# Altium schematic sheet PressSensor1.SchDoc
size A4; SheetNumber: 7; SheetTotal: 10
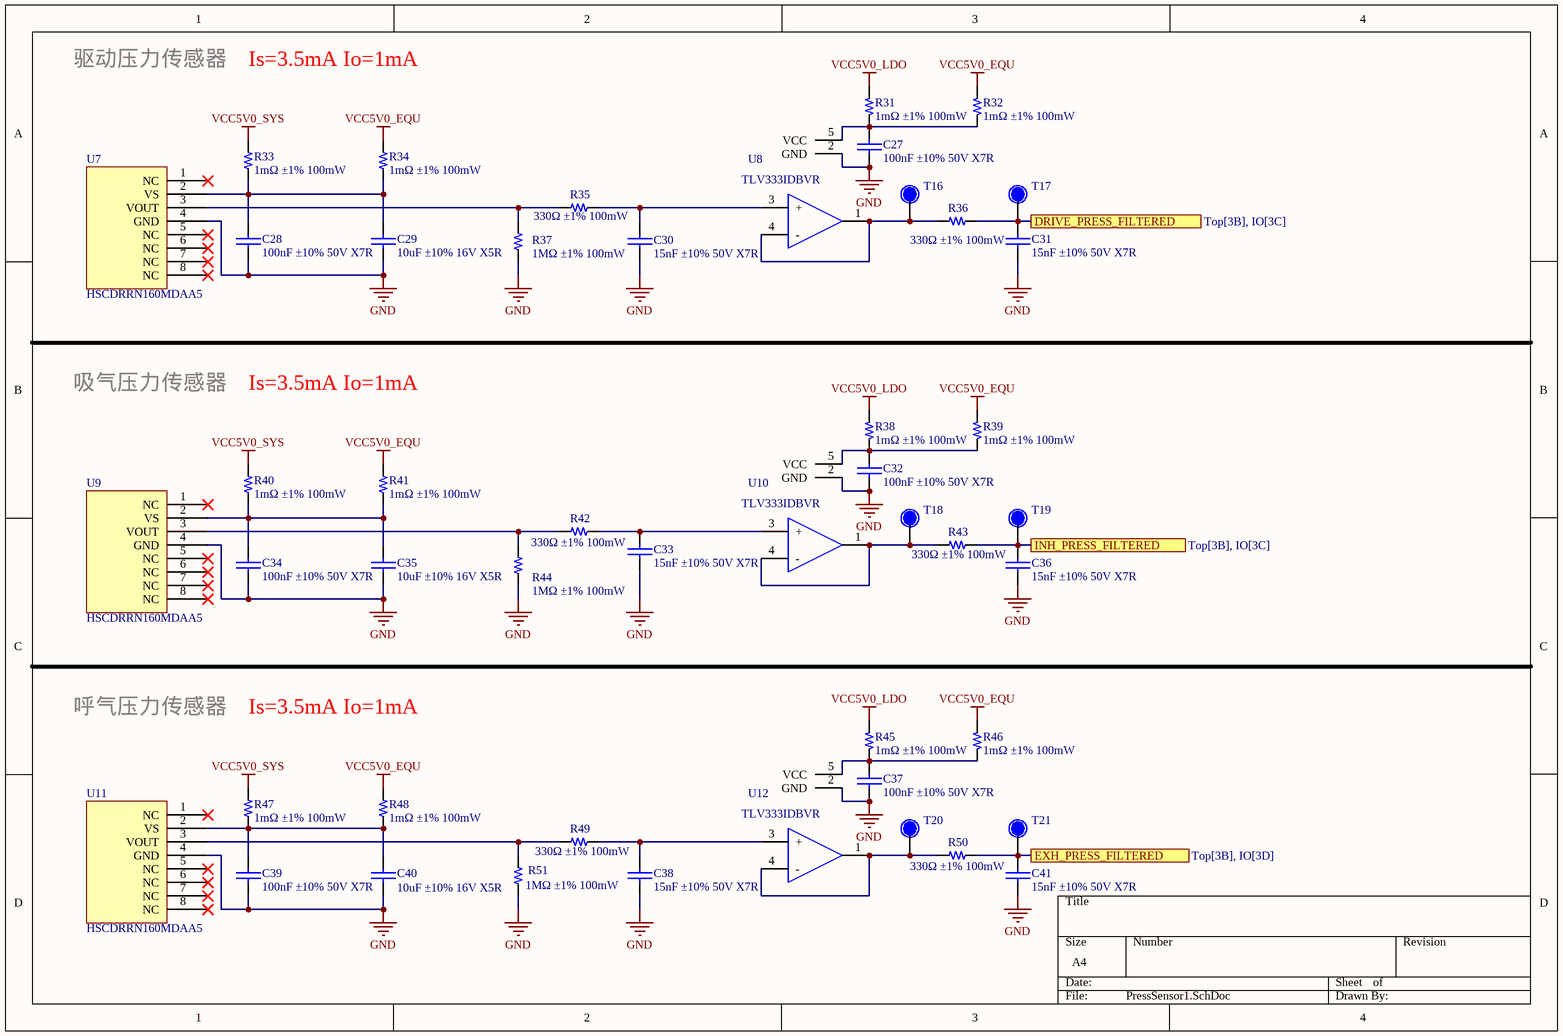
[diagram p0: PressSensor1.SchDoc]

## Parts
C27  100nF ±10% 50V X7R  [C-0603]
C28  100nF ±10% 50V X7R  [C-0603]
C29  10uF ±10% 16V X5R  [C-0805]
C30  15nF ±10% 50V X7R  [C-0603]
C31  15nF ±10% 50V X7R  [C-0603]
C32  100nF ±10% 50V X7R  [C-0603]
C33  15nF ±10% 50V X7R  [C-0603]
C34  100nF ±10% 50V X7R  [C-0603]
C35  10uF ±10% 16V X5R  [C-0805]
C36  15nF ±10% 50V X7R  [C-0603]
C37  100nF ±10% 50V X7R  [C-0603]
C38  15nF ±10% 50V X7R  [C-0603]
C39  100nF ±10% 50V X7R  [C-0603]
C40  10uF ±10% 16V X5R  [C-0805]
C41  15nF ±10% 50V X7R  [C-0603]
R31  1mΩ ±1% 100mW  [R-0603]
R32  1mΩ ±1% 100mW  [R-0603]
R33  1mΩ ±1% 100mW  [R-0603]
R34  1mΩ ±1% 100mW  [R-0603]
R35  330Ω ±1% 100mW  [R-0603]
R36  330Ω ±1% 100mW  [R-0603]
R37  1MΩ ±1% 100mW  [R-0603]
R38  1mΩ ±1% 100mW  [R-0603]
R39  1mΩ ±1% 100mW  [R-0603]
R40  1mΩ ±1% 100mW  [R-0603]
R41  1mΩ ±1% 100mW  [R-0603]
R42  330Ω ±1% 100mW  [R-0603]
R43  330Ω ±1% 100mW  [R-0603]
R44  1MΩ ±1% 100mW  [R-0603]
R45  1mΩ ±1% 100mW  [R-0603]
R46  1mΩ ±1% 100mW  [R-0603]
R47  1mΩ ±1% 100mW  [R-0603]
R48  1mΩ ±1% 100mW  [R-0603]
R49  330Ω ±1% 100mW  [R-0603]
R50  330Ω ±1% 100mW  [R-0603]
R51  1MΩ ±1% 100mW  [R-0603]
T16  Test?  [TestPad_SMD]  (value not drawn)
T17  Test?  [TestPad_SMD]  (value not drawn)
T18  Test?  [TestPad_SMD]  (value not drawn)
T19  Test?  [TestPad_SMD]  (value not drawn)
T20  Test?  [TestPad_SMD]  (value not drawn)
T21  Test?  [TestPad_SMD]  (value not drawn)
U7  HSCDRRN160MDAA5  [SSCDRR]
U8  TLV333IDBVR  [SOT23-5]
U9  HSCDRRN160MDAA5  [SSCDRR]
U10  TLV333IDBVR  [SOT23-5]
U11  HSCDRRN160MDAA5  [SSCDRR]
U12  TLV333IDBVR  [SOT23-5]

## Ports
DRIVE_PRESS_FILTERED (see Top[3B], IO[3C]), EXH_PRESS_FILTERED (see Top[3B], IO[3D]), INH_PRESS_FILTERED (see Top[3B], IO[3C])

## Nets
GND: C27.1 C28.1 C29.1 C30.1 C31.1 C32.1 C33.1 C34.1 C35.1 C36.1 C37.1 C38.1 C39.1 C40.1 C41.1 R37.2 R44.2 R51.2 U7.4(GND) U8.2(GND) U9.4(GND) U10.2(GND) U11.4(GND) U12.2(GND)
VCC5V0_EQU: R32.2(BOT) R34.1 R39.2(BOT) R41.1 R46.2(BOT) R48.1
VCC5V0_LDO: R31.2(BOT) R38.2(BOT) R45.2(BOT)
VCC5V0_SYS: R33.1 R40.1 R47.1
DRIVE_PRESS_FILTERED: C31.2 R36.1 T17.1 ; port DRIVE_PRESS_FILTERED
EXH_PRESS_FILTERED: C41.2 R50.1 T21.1 ; port EXH_PRESS_FILTERED
INH_PRESS_FILTERED: C36.2 R43.1 T19.1 ; port INH_PRESS_FILTERED
NetC27_2: C27.2 R31.1(TOP) R32.1(TOP) U8.5(VCC)
NetC28_2: C28.2 C29.2 R33.2 R34.2 U7.2(VS)
NetC30_2: C30.2 R35.1 U8.3(+)
NetC32_2: C32.2 R38.1(TOP) R39.1(TOP) U10.5(VCC)
NetC33_2: C33.2 R42.1 U10.3(+)
NetC34_2: C34.2 C35.2 R40.2 R41.2 U9.2(VS)
NetC37_2: C37.2 R45.1(TOP) R46.1(TOP) U12.5(VCC)
NetC38_2: C38.2 R49.1 U12.3(+)
NetC39_2: C39.2 C40.2 R47.2 R48.2 U11.2(VS)
NetR35_2: R35.2 R37.1 U7.3(VOUT)
NetR36_2: R36.2 T16.1 U8.1 U8.4(-)
NetR42_2: R42.2 R44.1 U9.3(VOUT)
NetR43_2: R43.2 T18.1 U10.1 U10.4(-)
NetR49_2: R49.2 R51.1 U11.3(VOUT)
NetR50_2: R50.2 T20.1 U12.1 U12.4(-)

Not connected (* = marked no-connect by the designer): U7 1(NC)* 5(NC)* 6(NC)* 7(NC)* 8(NC)*; U9 1(NC)* 5(NC)* 6(NC)* 7(NC)* 8(NC)*; U11 1(NC)* 5(NC)* 6(NC)* 7(NC)* 8(NC)*

## Notes on the sheet
- 驱动压力传感器
- Is=3.5mA Io=1mA
- 吸气压力传感器
- 呼气压力传感器

## Library data of the parts
C27 C28 C32 C34 C37 C39 = CAP
C29-C31 C33 C35 C36 C38 C40 C41 = CAP: Capacitor
R31 R32 R38 R39 R45 R46 = 10K_1: 国巨 / 1mΩ ±1% 100mW; 版本: V1.00; 名称: 贴片电阻10K±1%; 物料编号: 210001830; 详细描述: 0805,1/8W,国巨RC0805FR-0710K; 制造商: 国巨
R33 R34 R40 R41 R47 R48 = R-0603: 国巨 / 1mΩ ±1% 100mW
R35-R37 R42-R44 R49-R51 = R-0603
T16-T21 = TestPad_SMD
U7 U9 U11 = SSCMJJ010KDAA5
U8 U10 U12 = TLV333IDBVR: 品牌：TI，型号：TLV333IDBVR,SOIC-8,–25°~+85°C,单运放，ROHS